# Altium schematic sheet 3V8_SWITCHER.SchDoc
size A4; ApprovedBy: Mateusz Kowalik; CheckedBy: Mateusz Kowalik; Author: Mateusz Kowalik; CompanyName: InMotion Labs sp. z o.o.; DrawnBy: Mateusz Kowalik; Engineer: Mateusz Kowalik; Organization: InMotion Labs sp. z o.o.; Address1: Rydlówka 5A; Address2: 30-363 Kraków; Address4: Poland; DocumentNumber: 7; Revision: Rev 0; SheetNumber: 6; SheetTotal: 17
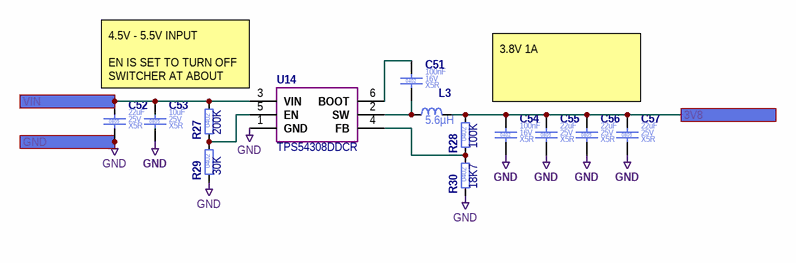
[diagram p0: 3V8_SWITCHER.SchDoc]

## Parts
C51  Case/Package: 0402  Voltage Rating (DC): 16V  Dielectric: X5R  Capacitance: 100nF  [C_0402_1005]  (hidden comment: C_100NF_16V_X5R_0402_10)
C52  Case/Package: 0805  Voltage Rating (DC): 25V  Dielectric: X5R  Capacitance: 22uF  [C_0805_2012]  (hidden comment: C_22UF_25V_X5R_0805_20)
C53  Case/Package: 0805  Voltage Rating (DC): 25V  Dielectric: X5R  Capacitance: 10uF  [C_0805_2012]  (hidden comment: C_10UF_25V_X5R_0805_10)
C54  Case/Package: 0402  Voltage Rating (DC): 16V  Dielectric: X5R  Capacitance: 100nF  [C_0402_1005]  (hidden comment: C_100NF_16V_X5R_0402_10)
C55  Case/Package: 0805  Voltage Rating (DC): 25V  Dielectric: X5R  Capacitance: 22uF  [C_0805_2012]  (hidden comment: C_22UF_25V_X5R_0805_20)
C56  Case/Package: 0805  Voltage Rating (DC): 25V  Dielectric: X5R  Capacitance: 22uF  [C_0805_2012]  (hidden comment: C_22UF_25V_X5R_0805_20)
C57  Case/Package: 0805  Voltage Rating (DC): 25V  Dielectric: X5R  Capacitance: 22uF  [C_0805_2012]  (hidden comment: C_22UF_25V_X5R_0805_20)
L3  Inductance: 5.6µH  [WE-MAPI_4030]  (hidden comment: 74438357056)
R27  Resistance: 200K  Case/Package: 0402  [R_0402_1005]  (hidden comment: R_200K_0402_1)
R28  Resistance: 100K  Case/Package: 0402  [R_0402_1005]  (hidden comment: R_100K_0402_1)
R29  Resistance: 30K  Case/Package: 0402  [R_0402_1005]  (hidden comment: R_30K_0402_1)
R30  Resistance: 18K7  Case/Package: 0402  [R_0402_1005]  (hidden comment: R_18K7_0402_1)
U14  TPS54308DDCR  [SOT23-6_SC74A_SOT753]

## Ports
3V8, GND, VIN

## Nets
GND: C52.2 C53.2 C54.2 C55.2 C56.2 C57.2 R29.1 R30.1 U14.1(GND) ; port GND
3V8: C54.1 C55.1 C56.1 C57.1 L3.2 R28.2 ; port 3V8
VIN: C52.1 C53.1 R27.2 U14.3(VIN) ; port VIN
NetC51_1: C51.1 U14.6(BOOT)
NetC51_2: C51.2 L3.1 U14.2(SW)
NetR27_1: R27.1 R29.2 U14.5(EN)
NetR28_1: R28.1 R30.2 U14.4(FB)

## Notes on the sheet
- 4.5V - 5.5V INPUT
  EN IS SET TO TURN OFF SWITCHER AT ABOUT 4.5V
- 3.8V 1A
- Title
- Size:
- Date:
- A4

## Library data of the parts
C51 C54 = C_100NF_16V_X5R_0402_10: Ceramic Capacitor; Manufacturer Part Number: EMK105BJ104KV-F; Manufacturer: Taiyo Yuden; Value: 100nF; Tolerance: 10%; Part Number: C_100NF_16V_X5R_0402_10; Mount: Surface Mount; Height: 500um; HelpURL: http://datasheet.octopart.com/EMK105BJ104KV-F-Taiyo-Yuden-datasheet-8857305.pdf; RoHS: Compliant; Max Operating Temperature: 125°C; Status: MK; Supplier 1: Mouser; Supplier Part Number 1: 963-EMK105BJ104KV-F; Manufacturer 2: Samsung Electro-Mechanics; Manufacturer Part Number 2: CL05B104KO5NNNC; Supplier 2: LCSC; Supplier Part Number 2: C1525
C52 C55-C57 = C_22UF_25V_X5R_0805_20: Ceramic Capacitor; Manufacturer Part Number: GRM21BR61E226ME44K; Manufacturer: Murata Electronics; Value: 22uF; Tolerance: 20%; Part Number: C_22UF_25V_X5R_0805_20; Mount: Surface Mount; Height: 1.25mm; HelpURL: http://datasheet.octopart.com/GRM21BR61E226ME44K-Murata-datasheet-14397511.pdf; RoHS: Compliant; Max Operating Temperature: 85°C; Status: MK; Supplier 1: Mouser; Supplier Part Number 1: 81-GRM21BR61E226ME4K; Supplier 2: LCSC; Supplier Part Number 2: C45783; Manufacturer 2: Samsung Electro-Mechanics; Manufacturer Part Number 2: CL21A226MAQNNNE
C53 = C_10UF_25V_X5R_0805_10: Ceramic Capacitor; Manufacturer Part Number: CL21A106KAYNNNE; Manufacturer: Samsung Electro-Mechanics; Value: 10uF; Tolerance: 10%; Part Number: C_10UF_25V_X5R_0805_10; Mount: Surface Mount; Height: 1.35mm; HelpURL: https://pl.mouser.com/datasheet/2/585/MLCC-1837944.pdf; RoHS: Compliant; Max Operating Temperature: 85°C; Status: MK; Supplier 1: Mouser; Supplier Part Number 1: 187-CL21A106KAYNNNE; Supplier 2: LCSC; Supplier Part Number 2: C15850; Manufacturer 2: Samsung Electro-Mechanics; Manufacturer Part Number 2: CL21A106KAYNNNE
L3 = 74438357056: Power Inductor; Manufacturer: Wurth Electronics; Value: 5.6µH; DC Current: 3.6A; Tolerance: 20%; DC Resistance: 46.5m; Saturation Current: 6A; Self Resonant Frequency: 21MHz; Part Number: 74438357056; Manufacturer Part Number: 74438357056; Case/Package: MAPI-4030; Mount: Surface Mount; Height: 3.1mm; HelpURL: https://www.we-online.com/catalog/en/datasheet/74438357056.pdf; Max Operating Temperature: 125°C; Status: MK; RoHS: Compliant; Supplier 1: Wurth electronics; Supplier Part Number 1: 74438357056
R27 = R_200K_0402_1: Thick Film Resistor; Manufacturer: Yageo; Manufacturer Part Number: RC0402FR-07200KL; Value: 200K; Tolerance: 1%; Voltage Rating (DC): 50V; Power Rating: 63mW; Stats: MK; Part Number: R_200K_0402_1; Mount: Surface Mount; Height: 350um; HelpURL: http://datasheet.octopart.com/RC0402FR-07200KL-Yageo-datasheet-10408619.pdf; RoHS: Compliant; Max Operating Temperature: 155°C; Supplier 1: Mouser; Supplier Part Number 1: 603-RC0402FR-07200KL; Manufacturer 2: Uniroyal Elec; Manufacturer Part Number 2: 0402WGJ0204TCE; Supplier 2: LCSC; Supplier Part Number 2: C25544
R28 = R_100K_0402_1: Thick Film Resistor; Manufacturer: Yageo; Manufacturer Part Number: RC0402FR-07100KL; Value: 100K; Tolerance: 1%; Voltage Rating (DC): 50V; Power Rating: 63mW; Stats: MK; Part Number: R_100K_0402_1; Mount: Surface Mount; Height: 350um; HelpURL: http://datasheet.octopart.com/RC0402FR-07100KL-Yageo-datasheet-127823281.pdf; RoHS: Compliant; Max Operating Temperature: 155°C; Supplier 1: Mouser; Supplier Part Number 1: 603-RC0402FR-07100KL; Manufacturer 2: Uniroyal Elec; Manufacturer Part Number 2: 0402WGF1003TCE; Supplier 2: LCSC; Supplier Part Number 2: C25741
R29 = R_30K_0402_1: Thick Film Resistor; Manufacturer: Yageo; Manufacturer Part Number: RC0402FR-0730KL; Value: 30K; Tolerance: 1%; Voltage Rating (DC): 50V; Power Rating: 63mW; Part Number: R_30K_0402_1; Mount: Surface Mount; Height: 350um; HelpURL: https://pl.mouser.com/datasheet/2/447/PYu-RC_Group_51_RoHS_L_10-1527934.pdf; Max Operating Temperature: 155°C; Supplier 1: Mouser; Supplier Part Number 1: 603-RC0402FR-0730KL; Manufacturer 2: Uniroyal Elec; Manufacturer Part Number 2: 0402WGF3002TCE; RoHS: Compliant; Supplier 2: LCSC; Supplier Part Number 2: C25776
R30 = R_18K7_0402_1: Thick Film Resistor; Manufacturer: Yageo; Manufacturer Part Number: RC0402FR-0718K7L; Value: 18K7; Tolerance: 1%; Voltage Rating (DC): 50V; Power Rating: 63mW; Stats: MK; Part Number: R_18K7_0402_1; Mount: Surface Mount; Height: 350um; HelpURL: https://pl.mouser.com/datasheet/2/447/PYu-RC_Group_51_RoHS_L_10-1527934.pdf; RoHS: Compliant; Max Operating Temperature: 155°C; Supplier 1: Mouser; Supplier Part Number 1: 603-RC0402FR-0718K7L; Manufacturer 2: Uniroyal Elec; Manufacturer Part Number 2: 0402WGF1872TCE; Supplier 2: LCSC; Supplier Part Number 2: C11476
U14 = TPS54308DDCR: FCCM SYNCHRONOUS STEP DOWN CONVE; Manufacturer: Texas Instruments; Number of Outputs: 1; Max Output Current: 5A; Min Output Voltage: 1.2V; Min Input Voltage: 4.5V; Max Input Voltage: 28V; Max Output Voltage: 28; Output Configuration: Buck; Quiescent Current: 300u; Box: 266; Part Number: TPS54308DDCR; Manufacturer Part Number: TPS54308DDCR; Max Operating Temperature: 125; Mount: surface mount; HelpURL: http://www.ti.com/lit/ds/symlink/tps54308.pdf; Number of Pins: 6; RoHS: Compliant; Case/Package: SOT23-6; Supplier 1: Mouser; Supplier Part Number 1: 595-TPS54308DDCR; Stock: 47